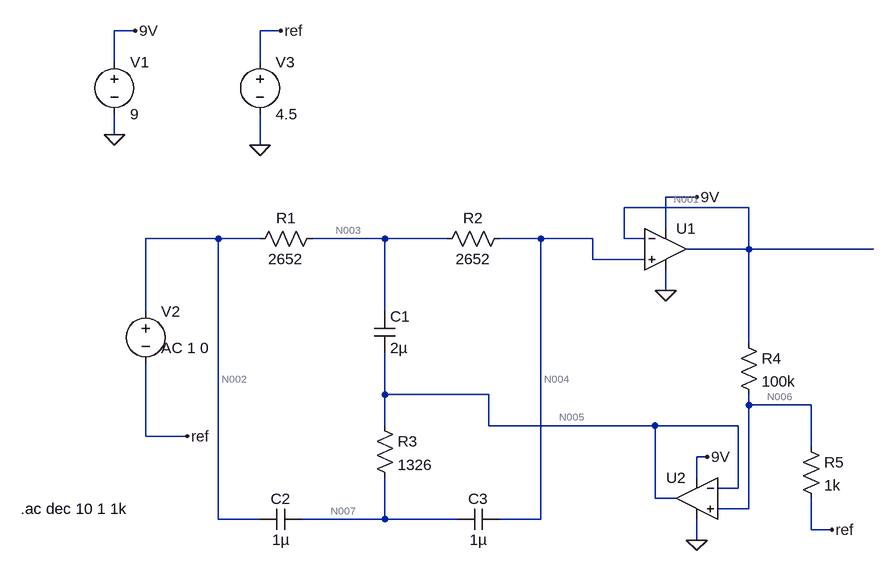
[diagram p0: schematic Twin T Notch Filter.asc]
Twin T Notch Filter.asc, the LTspice schematic file:
Version 4
SHEET 1 1284 876
WIRE 144 48 112 48
WIRE 368 48 336 48
WIRE 112 96 112 48
WIRE 336 96 336 48
WIRE 112 208 112 176
WIRE 336 224 336 176
WIRE 1008 304 960 304
WIRE 1088 320 896 320
WIRE 960 352 960 304
WIRE 272 368 160 368
WIRE 336 368 272 368
WIRE 528 368 416 368
WIRE 624 368 528 368
WIRE 768 368 704 368
WIRE 848 368 768 368
WIRE 896 368 896 320
WIRE 928 368 896 368
WIRE 1088 384 1088 320
WIRE 1088 384 992 384
WIRE 1280 384 1088 384
WIRE 848 400 848 368
WIRE 928 400 848 400
WIRE 960 448 960 416
WIRE 160 480 160 368
WIRE 528 480 528 368
WIRE 1088 528 1088 384
WIRE 528 608 528 544
WIRE 688 608 528 608
WIRE 1088 624 1088 608
WIRE 1184 624 1088 624
WIRE 528 656 528 608
WIRE 688 656 688 608
WIRE 944 656 688 656
WIRE 1072 656 944 656
WIRE 160 672 160 560
WIRE 224 672 160 672
WIRE 1184 688 1184 624
WIRE 1024 704 1008 704
WIRE 1008 736 1008 704
WIRE 1072 752 1072 656
WIRE 1072 752 1040 752
WIRE 944 768 944 656
WIRE 976 768 944 768
WIRE 1088 784 1088 624
WIRE 1088 784 1040 784
WIRE 272 800 272 368
WIRE 336 800 272 800
WIRE 528 800 528 736
WIRE 528 800 400 800
WIRE 640 800 528 800
WIRE 768 800 768 368
WIRE 768 800 704 800
WIRE 1184 816 1184 768
WIRE 1216 816 1184 816
WIRE 1008 832 1008 800
FLAG 112 208 0
FLAG 144 48 9V
FLAG 1024 704 9V
FLAG 1008 832 0
FLAG 1008 304 9V
FLAG 960 448 0
FLAG 336 224 0
FLAG 368 48 ref
FLAG 224 672 ref
FLAG 1216 816 ref
SYMBOL voltage 112 80 R0
WINDOW 123 0 0 Left 0
WINDOW 39 0 0 Left 0
SYMATTR InstName V1
SYMATTR Value 9
SYMBOL res 432 352 R90
WINDOW 0 0 56 VBottom 2
WINDOW 3 32 56 VTop 2
SYMATTR InstName R1
SYMATTR Value 2652
SYMBOL res 720 352 R90
WINDOW 0 0 56 VBottom 2
WINDOW 3 32 56 VTop 2
SYMATTR InstName R2
SYMATTR Value 2652
SYMBOL cap 512 480 R0
SYMATTR InstName C1
SYMATTR Value 2µ
SYMBOL res 512 640 R0
SYMATTR InstName R3
SYMATTR Value 1326
SYMBOL cap 400 784 R90
WINDOW 0 0 32 VBottom 2
WINDOW 3 32 32 VTop 2
SYMATTR InstName C2
SYMATTR Value 1µ
SYMBOL cap 704 784 R90
WINDOW 0 0 32 VBottom 2
WINDOW 3 32 32 VTop 2
SYMATTR InstName C3
SYMATTR Value 1µ
SYMBOL voltage 160 464 R0
WINDOW 3 24 44 Left 2
WINDOW 123 24 72 Left 2
WINDOW 39 0 0 Left 0
SYMATTR InstName V2
SYMATTR Value ""
SYMATTR Value2 AC 1 0
SYMBOL OpAmps\\UniversalOpAmp2 1008 768 M0
SYMATTR InstName U2
SYMBOL res 1072 512 R0
SYMATTR InstName R4
SYMATTR Value 100k
SYMBOL res 1168 672 R0
SYMATTR InstName R5
SYMATTR Value 1k
SYMBOL OpAmps\\UniversalOpAmp2 960 384 R0
SYMATTR InstName U1
SYMBOL voltage 336 80 R0
WINDOW 123 0 0 Left 0
WINDOW 39 0 0 Left 0
SYMATTR InstName V3
SYMATTR Value 4.5
TEXT -32 784 Left 2 !.ac dec 10 1 1k

The netlist it stands for:
* Twin T Notch Filter.asc
V1 9V 0 9
R1 N003 N002 2652
R2 N004 N003 2652
C1 N003 N005 2µ
R3 N005 N007 1326
C2 N007 N002 1µ
C3 N004 N007 1µ
V2 N002 ref AC 1 0
XU2 N006 N005 9V 0 N005 level2 Avol=1Meg GBW=10Meg Slew=10Meg Ilimit=25m Rail=0 Vos=0 En=0 Enk=0 In=0 Ink=0 Rin=500Meg  ; pins In+ In- V+ V- OUT
R4 N001 N006 100k
R5 N006 ref 1k
XU1 N004 N001 9V 0 N001 level2 Avol=1Meg GBW=10Meg Slew=10Meg Ilimit=25m Rail=0 Vos=0 En=0 Enk=0 In=0 Ink=0 Rin=500Meg  ; pins In+ In- V+ V- OUT
V3 ref 0 4.5
.ac dec 10 1 1k
.lib UniversalOpAmp2.lib
.backanno
.end

* Results of the author's LTspice run, read from the files saved beside the schematic
* Operating Point, zero values left out:
*   V(9v) = 9 V
*   V(n003) = 4.5 V
*   V(n002) = 4.5 V
*   V(n004) = 4.5 V
*   V(n005) = 4.5 V
*   V(n007) = 4.5 V
*   V(ref) = 4.5 V
*   V(n006) = 4.5 V
*   V(n001) = 4.5 V
*   I(V1) = -899.8 µA
*   Ix(u2:3) = 450 µA
*   Ix(u2:4) = -450 µA
*   Ix(u2:5) = 2.077 nA
*   Ix(u1:3) = 450 µA
*   Ix(u1:4) = -450 µA
*   Ix(u1:5) = 2.077 nA
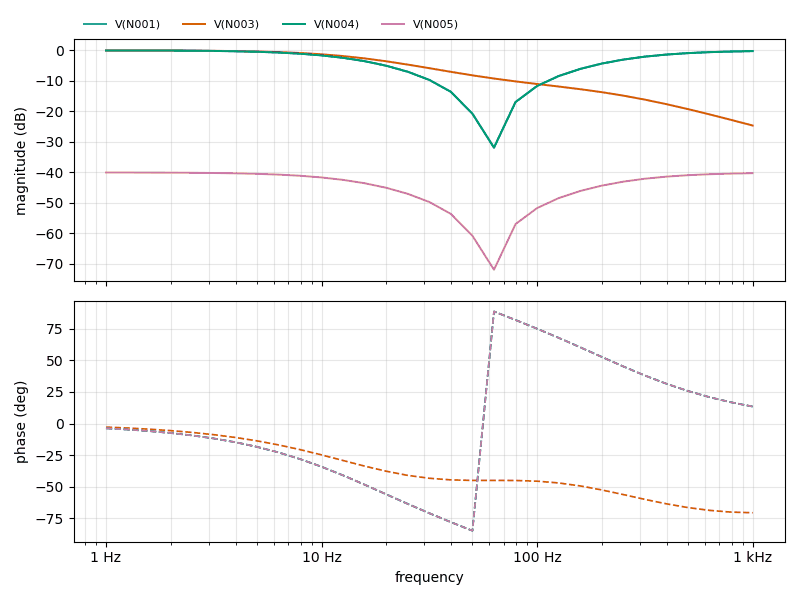
[diagram p1: AC Analysis of Twin T Notch Filter.asc, plotted from the saved traces]
* AC Analysis, 1 run:
*   V(N001): -0.02 dB at 1 Hz, -0.24 dB at 1 kHz, peak -0.02 dB at 1 Hz, 3 dB below the peak at 14.22 Hz
*   V(N003): -0.02 dB at 1 Hz, -24.68 dB at 1 kHz, peak -0.02 dB at 1 Hz, 3 dB below the peak at 17.41 Hz
*   V(N004): -0.02 dB at 1 Hz, -0.24 dB at 1 kHz, peak -0.02 dB at 1 Hz, 3 dB below the peak at 14.22 Hz
*   V(N005): -40.11 dB at 1 Hz, -40.33 dB at 1 kHz, peak -40.11 dB at 1 Hz, 3 dB below the peak at 14.22 Hz